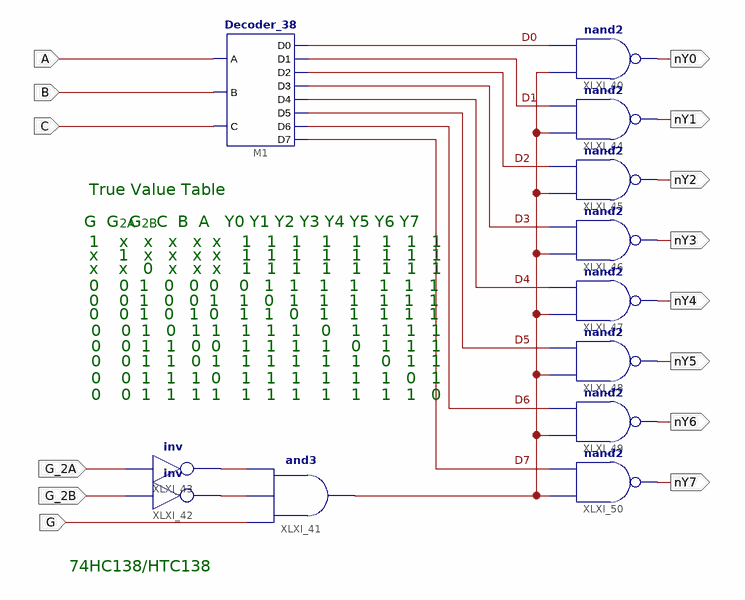
[diagram p0: schematic sheet 1]
// Xilinx ISE schematic HCT138.sch (spartan3) as structural Verilog: 12 symbols, 14 ports
module HCT138 (
  input  A,
  input  B,
  input  C,
  input  G_2B,
  input  G,
  input  G_2A,
  output nY0,
  output nY1,
  output nY2,
  output nY3,
  output nY4,
  output nY5,
  output nY6,
  output nY7
);

  wire D0, D1, D2, D3, D4, D5, D6, D7, XLXN_88, XLXN_89, XLXN_125;

  nand XLXI_40 (nY0, XLXN_125, D0);
  nand XLXI_44 (nY1, XLXN_125, D1);
  nand XLXI_45 (nY2, XLXN_125, D2);
  nand XLXI_46 (nY3, XLXN_125, D3);
  nand XLXI_47 (nY4, XLXN_125, D4);
  nand XLXI_48 (nY5, XLXN_125, D5);
  nand XLXI_49 (nY6, XLXN_125, D6);
  nand XLXI_50 (nY7, XLXN_125, D7);
  Decoder_38 M1 (.D1(D1), .D0(D0), .D2(D2), .D3(D3), .D5(D5), .D6(D6), .D7(D7), .D4(D4), .A(A), .B(B), .C(C));
  not XLXI_42 (XLXN_89, G_2B);
  and XLXI_41 (XLXN_125, G, XLXN_89, XLXN_88);
  not XLXI_43 (XLXN_88, G_2A);

  // Notes on the sheet:
  //   True Value Table
  //   G  G  G   C  B  A   Y0 Y1 Y2 Y3 Y4 Y5 Y6 Y7
  //   2A
  //   2B
  //   1    x   x   x   x  x    1   1   1    1    1    1   1   1
  //   x    1   x   x   x  x    1   1   1    1    1    1   1   1
  //   x    x   0   x   x  x    1   1   1    1    1    1   1   1
  //   0    0  1   0   0  0    0   1   1    1    1    1   1   1
  //   0    0  1   0   0  1    1   0   1    1    1    1   1   1
  //   0    0  1   0   1  0    1   1   0    1    1    1   1   1
  //   0    0  1   0   1  1    1   1   1    0    1    1   1   1
  //   0    0  1   1   0  0    1   1   1    1    0    1   1   1
  //   0    0  1   1   0  1    1   1   1    1    1    0   1   1
  //   0    0  1   1   1  0    1   1   1    1    1    1   0   1
  //   0    0  1   1   1  1    1   1   1    1    1    1   1   0
  //   74HC138/HTC138
endmodule
